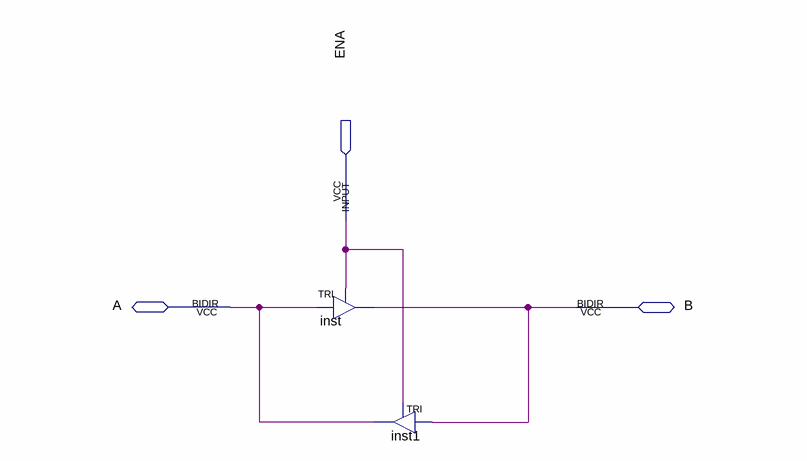
[diagram p0: schematic sheet]
// Quartus schematic tri2.bdf as structural Verilog: 2 symbols, 3 pins
module tri2 (
  input  ENA,
  inout  A,
  inout  B
);

  TRI inst (.IN(A), .OE(ENA), .OUT(B));
  TRI inst1 (.IN(B), .OE(ENA), .OUT(A));
endmodule
